# Altium schematic sheet AMX_sensors30.SchDoc
size A
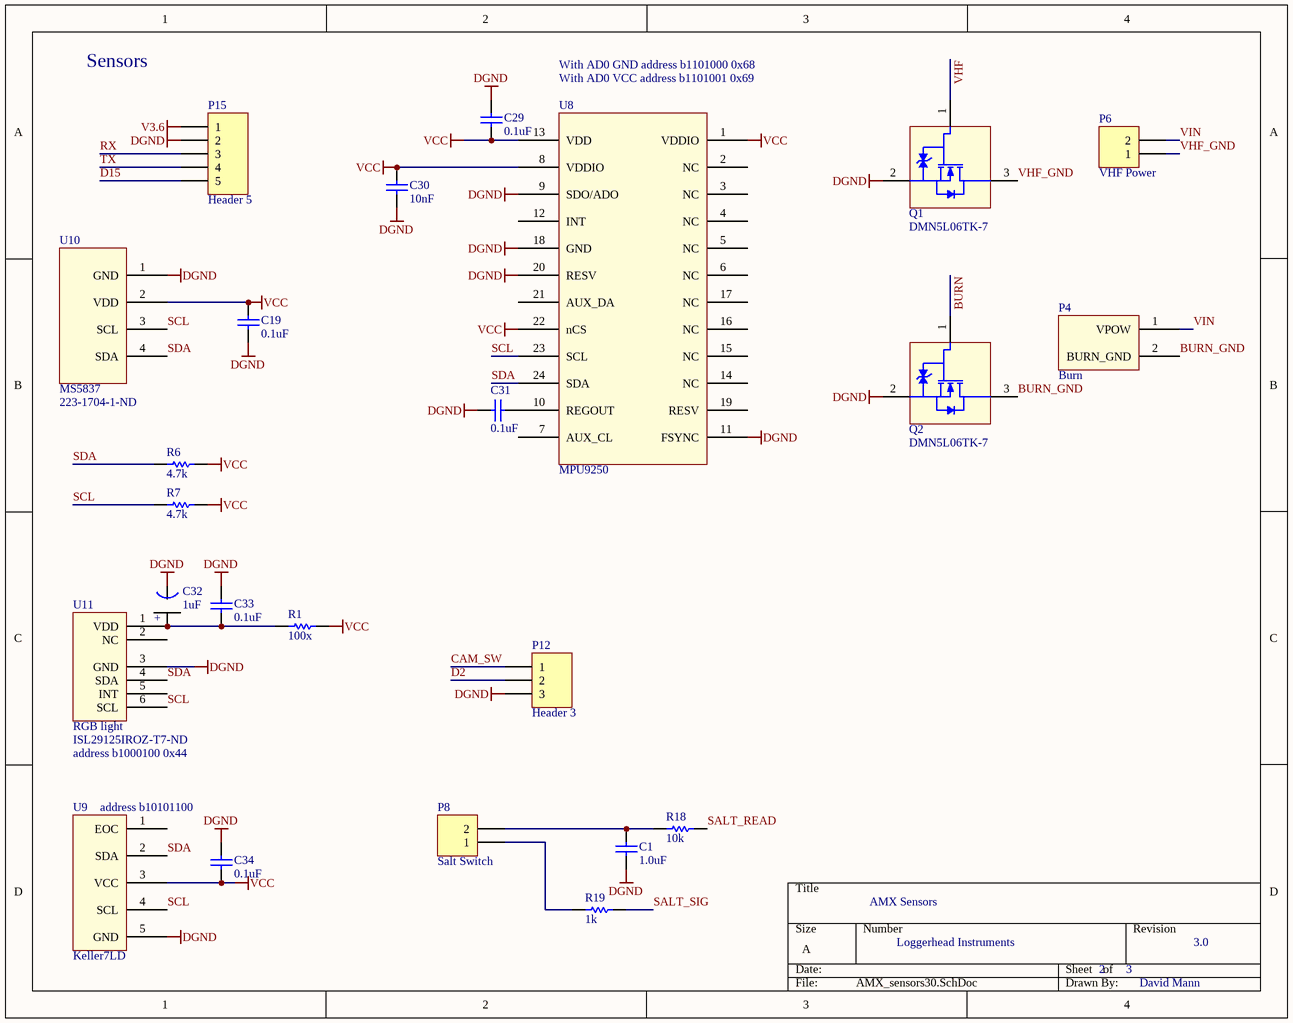
[diagram p0: AMX_sensors30.SchDoc]

## Parts
C1  1.0uF  [0402]
C19  0.1uF  [0402]
C29  0.1uF  [0402]
C30  10nF  [0402]
C31  0.1uF  [0402]
C32  1uF  [Tant0805]
C33  0.1uF  [0402]
C34  0.1uF  [0402]
P4  Burn  [BURN]
P6  VHF Power  [HDR1X2]
P8  Salt Switch  [HDR1X2]
P12  Header 3  [HDR1X3]
P15  Header 5  [HDR1X5]
Q1  DMN5L06TK-7  [SOT-523]
Q2  DMN5L06TK-7  [SOT-523]
R1  100x  [3-0603]
R6  4.7k  [3-0603]
R7  4.7k  [3-0603]
R18  10k  [3-0603]
R19  1k  [3-0603]
U8  MPU9250  [MPU6500]
U9  Keller7LD  [Keller7LD]
U10  MS5837  Supplier Part Number 1: 223-1704-1-ND  [MS5837]
U11  RGB light  Supplier Part Number 1: ISL29125IROZ-T7-ND  [ODFN]

## Nets
DGND: C1.2 C19.1 C29.2 C30.2 C31.1 C32.1(GND) C33.2 C34.2 P12.3 P15.2 Q1.2(S) Q2.2(S) U8.9(SDO/ADO) U8.11(FSYNC) U8.18(GND) U8.20(RESV) U9.5(GND) U10.1(GND) U11.3(GND)
V3.6: P15.1
VCC: C19.2 C29.1 C30.1 C34.1 R1.1 R6.1 R7.2 U8.1(VDDIO) U8.8(VDDIO) U8.13(VDD) U8.22(nCS) U9.3(VCC) U10.2(VDD)
BURN: Q2.1(G)
BURN_GND: P4.2(BURN_GND) Q2.3(D)
CAM_SW: P12.1
D2: P12.2
D15: P15.5
RX: P15.3
SALT_READ: R18.1
SALT_SIG: R19.2
SCL: R7.1 U8.23(SCL) U9.4(SCL) U10.3(SCL) U11.6(SCL)
SDA: R6.2 U8.24(SDA) U9.2(SDA) U10.4(SDA) U11.4(SDA)
TX: P15.4
VHF: Q1.1(G)
VHF_GND: P6.1 Q1.3(D)
VIN: P4.1(VPOW) P6.2
NetC1_1: C1.1 P8.2 R18.2
NetC31_2: C31.2 U8.10(REGOUT)
NetC32_2: C32.2(+) C33.1 R1.2 U11.1(VDD)
NetP8_1: P8.1 R19.1

Not connected (* = marked no-connect by the designer): U8 2(NC) 3(NC) 4(NC) 5(NC) 6(NC) 7(AUX_CL) 12(INT) 14(NC) 15(NC) 16(NC) 17(NC) 19(RESV) 21(AUX_DA); U9 1(EOC); U11 2(NC) 5(INT)

## Notes on the sheet
- Sensors
- With AD0 GND address b1101000 0x68
- With AD0 VCC address b1101001 0x69
- (near U11) address b1000100 0x44
- (near U9) address b10101100
- AMX Sensors
- Loggerhead Instruments
- 2
- 3
- 3.0
- David Mann

## Library data of the parts
C1 = C0402: Ceramic Chip Capacitor - Standard; Note: Footprint corresponds to dimensions for bulk cassette packaging. This case size has tightened tolerances.; Value: 0.1uF; Published: 17-Jul-2002; LatestRevisionDate: 19-Mar-2004; LatestRevisionNote: Silkscreen size reduced.; DatasheetDocument: Mar-2001; PackageDocument: Mar-2001; PackageReference: 0402; Publisher: Altium Limited; Code_JEITA: 0402; Code_IPC: 1005 [0402]; ComponentLink1Description: Manufacturer Link; ComponentLink1URL: http://www.kemet.com/; ComponentLink2Description: Datasheet; ComponentLink2URL: http://www.kemet.com/kemet/web/homepage/kechome.nsf/vapubfilesname/F3102TA.pdf/$file/F3102TA.pdf
C19 C29-C31 C33 C34 = C0402: Ceramic Chip Capacitor - Standard; Note: Footprint corresponds to dimensions for bulk cassette packaging. This case size has tightened tolerances.; Published: 17-Jul-2002; LatestRevisionDate: 19-Mar-2004; LatestRevisionNote: Silkscreen size reduced.; DatasheetDocument: Mar-2001; PackageDocument: Mar-2001; PackageReference: 0402; Publisher: Altium Limited; Code_JEITA: 0402; Code_IPC: 1005 [0402]; ComponentLink1Description: Manufacturer Link; ComponentLink1URL: http://www.kemet.com/; ComponentLink2Description: Datasheet; ComponentLink2URL: http://www.kemet.com/kemet/web/homepage/kechome.nsf/vapubfilesname/F3102TA.pdf/$file/F3102TA.pdf
  C19 C29 C31 C33 C34: Value: 0.1uF
  C30: Value: 10nF
C32 = Tant0805: Value: 1uF
P4 = Burn Screw
P6 P8 = Header 2: Header, 2-Pin; LatestRevisionDate: 17-Jul-2002; LatestRevisionNote: Re-released for DXP Platform.; Publisher: Altium Limited
P12 = Header 3: Header, 3-Pin; LatestRevisionDate: 17-Jul-2002; LatestRevisionNote: Re-released for DXP Platform.; Publisher: Altium Limited
P15 = Header 5: Header, 5-Pin; LatestRevisionDate: 17-Jul-2002; LatestRevisionNote: Re-released for DXP Platform.; Publisher: Altium Limited
Q1 Q2 = FET DMN5L06TK-7: Ultra-low leakage Enhanced MOSFET; Fabrication Tested: NO; Creator and Date: Will Flanery 2010-09-02; Footprint Verified By: *; Schematic Verified By: *; Vendor Info Verified By: *; Supplier 1: Digi-Key; Supplier Part Number 1: DMN5L06TKDICT-ND; HelpURL: http://www.diodes.com/datasheets/ds30926.pdf
R1 R6 R7 R18 R19 = ERJ3RK: Precision Thick Film Chip Resistor, 10 Ohm to 1M Ohm Range, 1% and 0.5% Tolerance, 0603 Size, 0.063 W; Published: 17-Dec-2003; LatestRevisionDate: 19-Mar-2004; LatestRevisionNote: Silkscreen size reduced.; PackageDocument: Mar-2003; PackageReference: 3-0603; Publisher: Altium Limited; Code_IPC: 1608 [0603]; ComponentLink1Description: Manufacturer Link; ComponentLink1URL: http://www.panasonic.com/industrial/components/resistive_products.htm; ComponentLink2Description: Datasheet; ComponentLink2URL: http://www.panasonic.com/industrial/components/pdf/AOA0000CE2.pdf
U8 = MPU-9250: Invensense
U9 = Keller 7LD: Keller Pressure/Temp; PDF: http://www.kelleramerica.com/pdf-library/Piezoresistive%20OEM%20Pressure%20Transmitters%20with%20I2C%20interface%20and%20embedded%20signal%20conditioning.pdf
U10 = MS5837: Pressure/Temp; Supplier 1: Digi-Key
U11 = ISL29125: RGB light sensor; Supplier 1: Digi-Key